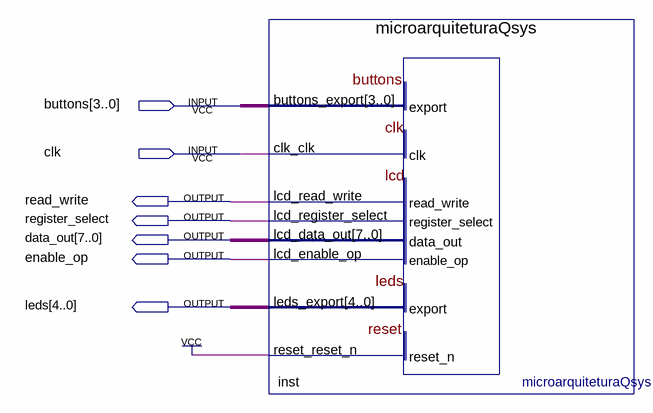
[diagram p0: schematic sheet]
// Quartus schematic microarquitetura.bdf as structural Verilog: 1 symbols, 7 pins
module microarquitetura (
  input  [3:0] buttons,
  input  clk,
  output read_write,
  output register_select,
  output [7:0] data_out,
  output enable_op,
  output [4:0] leds
);

  microarquiteturaQsys inst (
    .buttons_export(buttons), .clk_clk(clk), .reset_reset_n(1'b1), .lcd_read_write(read_write),
    .lcd_register_select(register_select), .lcd_data_out(data_out), .lcd_enable_op(enable_op),
    .leds_export(leds));
endmodule
